# EAGLE design Debug Board - Rev. A (EAGLE 9.6.2)
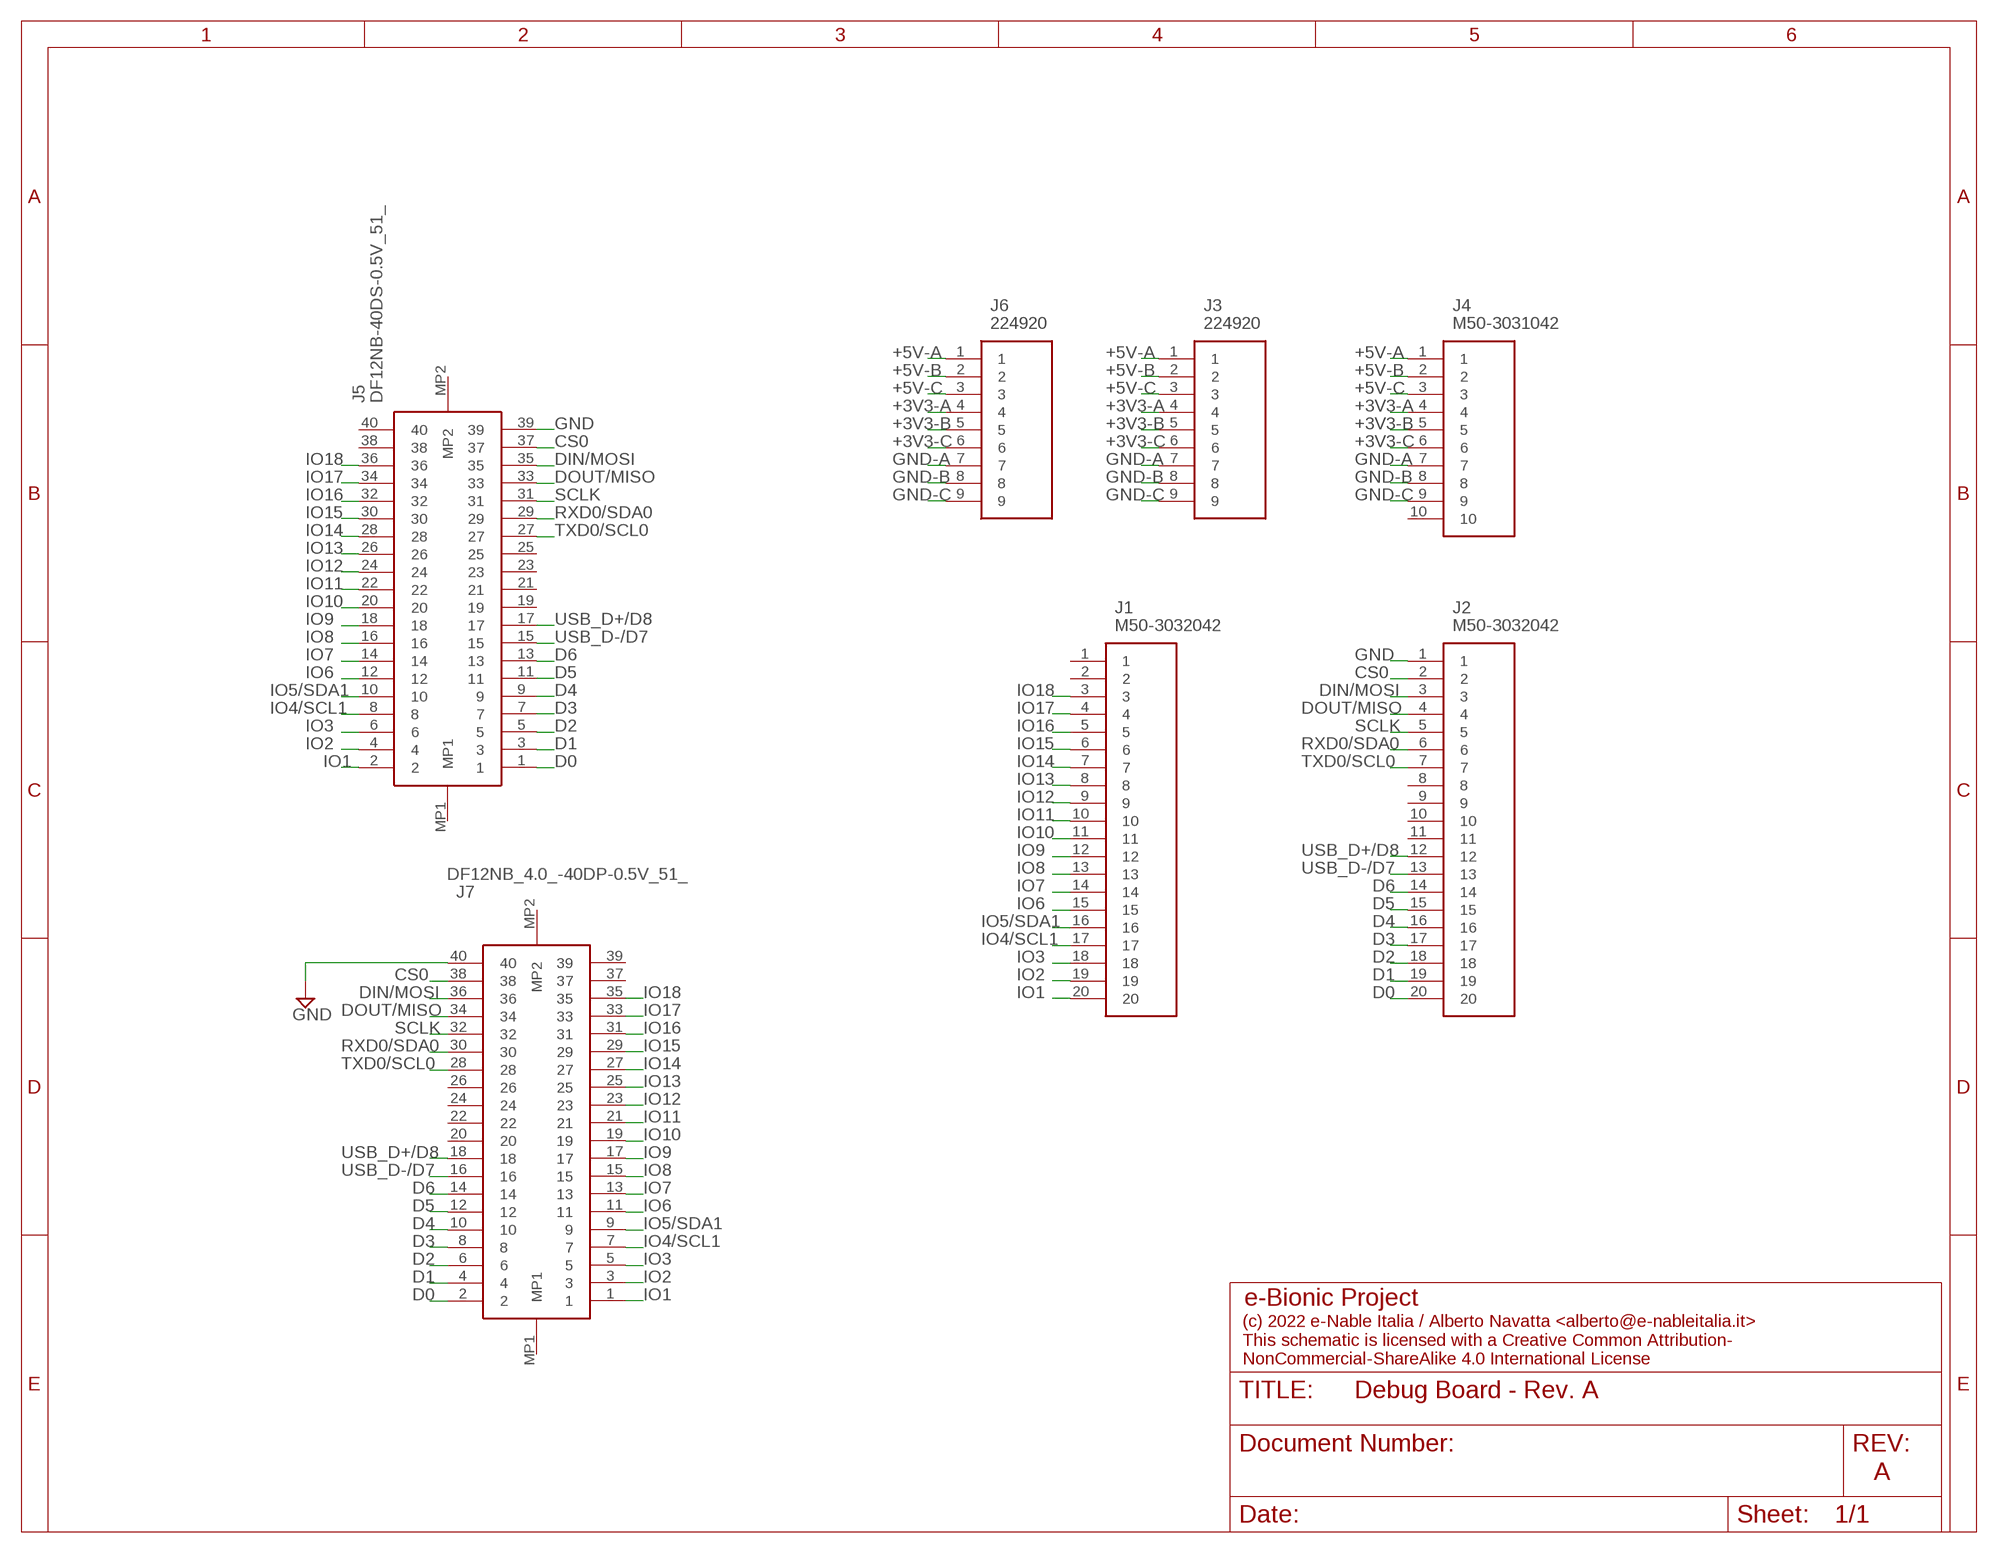
[diagram p0: schematic, sheet 1]

## Parts
J1  M50-3032042  [M503032042]
J2  M50-3032042  [M503032042]
J3  224920  [224920]
J4  M50-3031042  [M503031042]
J5  DF12NB-40DS-0.5V_51_  [DF12NB40DS05V51]
J6  224920  [224920]
J7  DF12NB_4.0_-40DP-0.5V_51_  [DF12NB4040DP05V51]

## Nets
+3V3-A [Power]: J3.4 J4.4 J6.4
+3V3-B [Power]: J3.5 J4.5 J6.5
+3V3-C [Power]: J3.6 J4.6 J6.6
+5V-A [Power]: J3.1 J4.1 J6.1
+5V-B [Power]: J3.2 J4.2 J6.2
+5V-C [Power]: J3.3 J4.3 J6.3
CS0: J2.2 J5.37 J7.38
D0: J2.20 J5.1 J7.2
D1: J2.19 J5.3 J7.4
D2: J2.18 J5.5 J7.6
D3: J2.17 J5.7 J7.8
D4: J2.16 J5.9 J7.10
D5: J2.15 J5.11 J7.12
D6: J2.14 J5.13 J7.14
DIN/MOSI: J2.3 J5.35 J7.36
DOUT/MISO: J2.4 J5.33 J7.34
GND [GND]: J2.1 J5.39 J7.40
GND-A [GND]: J3.7 J4.7 J6.7
GND-B [GND]: J3.8 J4.8 J6.8
GND-C [GND]: J3.9 J4.9 J6.9
IO1: J1.20 J5.2 J7.1
IO2: J1.19 J5.4 J7.3
IO3: J1.18 J5.6 J7.5
IO4/SCL1: J1.17 J5.8 J7.7
IO5/SDA1: J1.16 J5.10 J7.9
IO6: J1.15 J5.12 J7.11
IO7: J1.14 J5.14 J7.13
IO8: J1.13 J5.16 J7.15
IO9: J1.12 J5.18 J7.17
IO10: J1.11 J5.20 J7.19
IO11: J1.10 J5.22 J7.21
IO12: J1.9 J5.24 J7.23
IO13: J1.8 J5.26 J7.25
IO14: J1.7 J5.28 J7.27
IO15: J1.6 J5.30 J7.29
IO16: J1.5 J5.32 J7.31
IO17: J1.4 J5.34 J7.33
IO18: J1.3 J5.36 J7.35
RXD0/SDA0: J2.6 J5.29 J7.30
SCLK: J2.5 J5.31 J7.32
TXD0/SCL0: J2.7 J5.27 J7.28
USB_D+/D8: J2.12 J5.17 J7.18
USB_D-/D7: J2.13 J5.15 J7.16
Unconnected: J1.1 J1.2 J2.8 J2.9 J2.10 J2.11 J4.10 J5.19 J5.21 J5.23 J5.25 J5.38 J5.40 J5.MP1 J5.MP2 J7.20 J7.22 J7.24 J7.26 J7.37 J7.39 J7.MP1 J7.MP2

## Notes on the sheet
- e-Bionic Project
- (c) 2022 e-Nable Italia / Alberto Navatta <alberto@e-nableitalia.it>
  This schematic is licensed with a Creative Common Attribution-
  NonCommercial-ShareAlike 4.0 International License
- A

## Library data of the parts
J1 J2 = SamacSys_Parts:M50-3032042: Headers & Wire Housings 20 WAY SIL VERT PC TAIL SKT Source: Datasheet <https://cdn.harwin.com/pdfs/M50-303.pdf>; DESCRIPTION: Headers & Wire Housings 20 WAY SIL VERT PC TAIL SKT; HEIGHT: 4.55mm; MANUFACTURER_NAME: Harwin; MANUFACTURER_PART_NUMBER: M50-3032042; MOUSER_PART_NUMBER: 855-M50-3032042; MOUSER_PRICE-STOCK: https://www.mouser.co.uk/ProductDetail/Harwin/M50-3032042?qs=%252BdQmOuGyFcG1Q4VMzC2p1Q%3D%3D
J3 J6 = SamacSys_Parts:224920: Board to Board & Mezzanine Connectors 9P 0.8MM VERT FML CLASS 4 3MM SMT Source: Datasheet; DESCRIPTION: Board to Board & Mezzanine Connectors 9P 0.8MM VERT FML CLASS 4 3MM SMT; HEIGHT: 3.96mm; MANUFACTURER_NAME: ERNI; MANUFACTURER_PART_NUMBER: 224920; MOUSER_PART_NUMBER: 305-224920; MOUSER_PRICE-STOCK: https://www.mouser.co.uk/ProductDetail/ERNI/224920?qs=Kh9WxvXxjWmfiTh6L%2FvUxg%3D%3D
J4 = SamacSys_Parts:M50-3031042: Headers & Wire Housings 10 WAY SIL VERT PC TAIL SKT Source: Datasheet <https://cdn.harwin.com/pdfs/M50-303.pdf>; DESCRIPTION: Headers & Wire Housings 10 WAY SIL VERT PC TAIL SKT; HEIGHT: 4.55mm; MANUFACTURER_NAME: Harwin; MANUFACTURER_PART_NUMBER: M50-3031042; MOUSER_PART_NUMBER: 855-M50-3031042; MOUSER_PRICE-STOCK: https://www.mouser.co.uk/ProductDetail/Harwin/M50-3031042?qs=%252BdQmOuGyFcGr7bDrWORUuA%3D%3D
J5 = SamacSys_Parts:DF12NB-40DS-0.5V_51_: Board to Board & Mezzanine Connectors CONN RCPT 36POS SMD Source: Datasheet <https://www.hirose.com/en/product/document?clcode=CL0537-0290-0-51&productname=DF12NB-40DS-0.5V(51)&series=DF12N&documenttype=2DDrawing&lang=en&documentid=0001367362>; DESCRIPTION: Board to Board & Mezzanine Connectors CONN RCPT 36POS SMD; HEIGHT: 2.9mm; MANUFACTURER_NAME: Hirose; MANUFACTURER_PART_NUMBER: DF12NB-40DS-0.5V(51); MOUSER_PART_NUMBER: 798-DF12NB40DS0551; MOUSER_PRICE-STOCK: https://www.mouser.co.uk/ProductDetail/Hirose-Connector/DF12NB-40DS-0.5V51?qs=DPoM0jnrROV9WbEBnogTmg%3D%3D
J7 = SamacSys_Parts:DF12NB_4.0_-40DP-0.5V_51_: Board to!! Board !! & Mezzanine Connectors CONN HDR 40POS SMD G Source: Datasheet <https://www.hirose.com/en/product/document?clcode=CL0537-0596-0-51&productname=DF12NB(4.0)-40DP-0.5V(51)&series=DF12N&documenttype=2DDrawing&lang=en&documentid=0001367371>; DESCRIPTION: Board to!! Board !! & Mezzanine Connectors CONN HDR 40POS SMD G; HEIGHT: 3.5mm; MANUFACTURER_NAME: Hirose; MANUFACTURER_PART_NUMBER: DF12NB(4.0)-40DP-0.5V(51); MOUSER_PART_NUMBER: 798-DF12NB4040DP0551; MOUSER_PRICE-STOCK: https://www.mouser.co.uk/ProductDetail/Hirose-Connector/DF12NB4.0-40DP-0.5V51?qs=DPoM0jnrROUKZpllIjGjYw%3D%3D

## Net classes
2 Power: width 0.203 mm

## Board
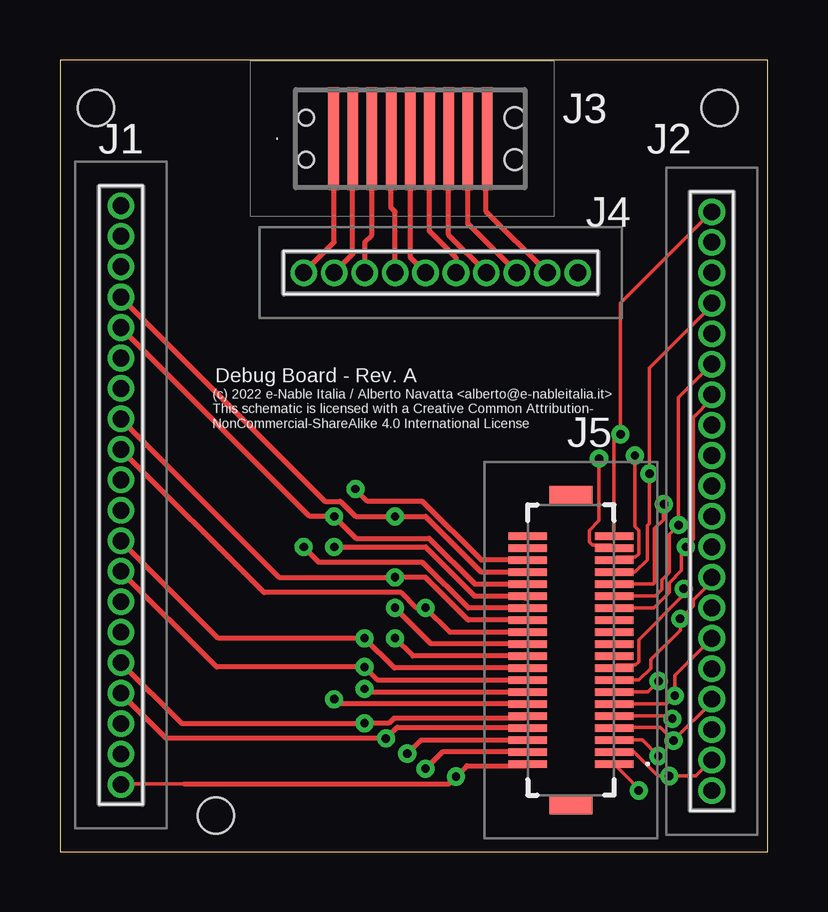
[diagram p1: board, top side]
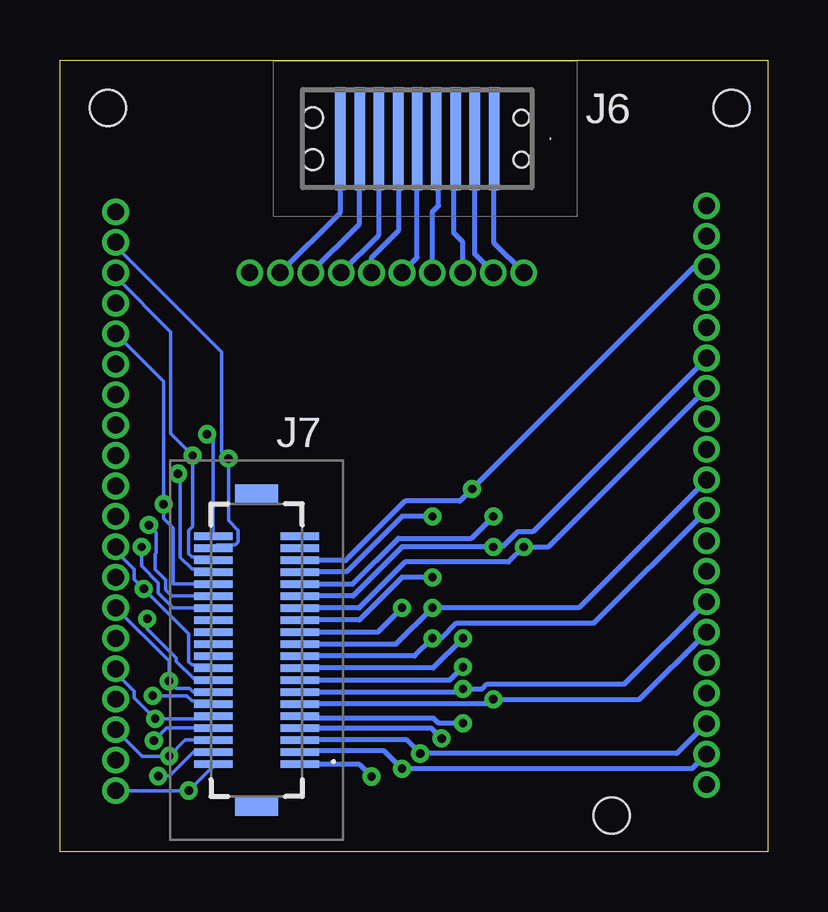
[diagram p2: board, bottom side, seen from below]

Size 29.5 x 33 mm. Coordinates in mm from the lower left corner, seen from the top.
Outline: 0,0 29.5,0 29.5,33 0,33 0,0
Copper layers (1*16): Top 0.035mm / dielectric 1.5mm / Bottom 0.035mm
Design rules "default *": minimum track width 6mil, minimum drill 0.35mm, track to track 6mil, track to pad 6mil, pad to pad 6mil, via to via 6mil, smd to smd 6mil, copper to edge 18mil, drill to drill 6mil, minimum pad ring 8mil, minimum via ring 8mil, stop-mask expansion 4mil, vias tented up to drill 0mil, thermal gap 10mil
Holes 1.5 mm at 1.5,31 27.5,31 6.5,1.5

### Footprints (pad centres in the part's own frame; a part is rotated, then mirrored left to right if it is on the bottom)
M503032042 = drill 0.7 pad 1.1: 1 0,0; 2 1.27,0; 3 2.54,0; 4 3.81,0; 5 5.08,0; 6 6.35,0; 7 7.62,0; 8 8.89,0; 9 10.16,0; 10 11.43,0; 11 12.7,0; 12 13.97,0; 13 15.24,0; 14 16.51,0; 15 17.78,0; 16 19.05,0; 17 20.32,0; 18 21.59,0; 19 22.86,0; 20 24.13,0
224920 = smd 0.44 x 4.3: 1 -3.2,0; 2 -2.4,0; 3 -1.6,0; 4 -0.8,0; 5 0,0; 6 0.8,0; 7 1.6,0; 8 2.4,0; 9 3.2,0 | hole 0.65: -4.35,0.88 | hole 0.85: 4.35,0.88
M503031042 = drill 0.7 pad 1.1: 1 0,0; 2 1.27,0; 3 2.54,0; 4 3.81,0; 5 5.08,0; 6 6.35,0; 7 7.62,0; 8 8.89,0; 9 10.16,0; 10 11.43,0
DF12NB40DS05V51 = smd 0.3 x 1.6: 1 -4.75,-1.8; 2 -4.75,1.8; 3 -4.25,-1.8; 4 -4.25,1.8; 5 -3.75,-1.8; 6 -3.75,1.8; 7 -3.25,-1.8; 8 -3.25,1.8; 9 -2.75,-1.8; 10 -2.75,1.8; 11 -2.25,-1.8; 12 -2.25,1.8; 13 -1.75,-1.8; 14 -1.75,1.8; 15 -1.25,-1.8; 16 -1.25,1.8; 17 -0.75,-1.8; 18 -0.75,1.8; 19 -0.25,-1.8; 20 -0.25,1.8; 21 0.25,-1.8; 22 0.25,1.8; 23 0.75,-1.8; 24 0.75,1.8; 25 1.25,-1.8; 26 1.25,1.8; 27 1.75,-1.8; 28 1.75,1.8; 29 2.25,-1.8; 30 2.25,1.8; 31 2.75,-1.8; 32 2.75,1.8; 33 3.25,-1.8; 34 3.25,1.8; 35 3.75,-1.8; 36 3.75,1.8; 37 4.25,-1.8; 38 4.25,1.8; 39 4.75,-1.8; 40 4.75,1.8 | smd 0.8 x 1.8: MP1 -6.45,0; MP2 6.45,0
DF12NB4040DP05V51 = smd 0.3 x 1.6: 1 -4.75,-1.8; 2 -4.75,1.8; 3 -4.25,-1.8; 4 -4.25,1.8; 5 -3.75,-1.8; 6 -3.75,1.8; 7 -3.25,-1.8; 8 -3.25,1.8; 9 -2.75,-1.8; 10 -2.75,1.8; 11 -2.25,-1.8; 12 -2.25,1.8; 13 -1.75,-1.8; 14 -1.75,1.8; 15 -1.25,-1.8; 16 -1.25,1.8; 17 -0.75,-1.8; 18 -0.75,1.8; 19 -0.25,-1.8; 20 -0.25,1.8; 21 0.25,-1.8; 22 0.25,1.8; 23 0.75,-1.8; 24 0.75,1.8; 25 1.25,-1.8; 26 1.25,1.8; 27 1.75,-1.8; 28 1.75,1.8; 29 2.25,-1.8; 30 2.25,1.8; 31 2.75,-1.8; 32 2.75,1.8; 33 3.25,-1.8; 34 3.25,1.8; 35 3.75,-1.8; 36 3.75,1.8; 37 4.25,-1.8; 38 4.25,1.8; 39 4.75,-1.8; 40 4.75,1.8 | smd 0.8 x 1.8: MP1 -6.5,0; MP2 6.5,0

### Placement (x,y rotation side)
J1  2.54,26.92 270 top
J2  27.18,26.67 270 top
J3  14.61,29.72 0 top
J4  10.16,24.13 0 top
J5  21.3,8.4 90 top
J6  14.61,29.72 180 bottom
J7  21.3,8.4 90 bottom

### Tracks (layer width: path | path; a pad name or v marks a point on that pad's centre or on a via)
+3V3-A
  Top 0.203: J4.4 13.97,26.67 13.8,26.84 J6.4
  Bottom 0.203: J6.4 13.72,29.63 13.72,26.92 13.97,26.67 J4.4
+3V3-B
  Top 0.203: J4.5 14.61,24.77 J6.5
  Bottom 0.203: J4.5 14.61,24.77 J6.5
+3V3-C
  Top 0.203: J4.6 16.51,24.77 15.4,25.87 J6.6
  Bottom 0.203: J4.6 16.51,24.77 15.37,25.91 15.37,29.68 J6.6
+5V-A
  Top 0.203: J6.1 11.43,29.69 11.43,25.4 J4.1
  Bottom 0.203: J4.1 11.4,25.38 J6.1
+5V-B
  Top 0.203: J4.2 12.21,24.91 J6.2
  Bottom 0.203: J6.2 12.21,24.91 J4.2
+5V-C
  Top 0.203: J4.3 12.7,25.4 13.01,25.7 J6.3
  Bottom 0.203: J4.3 12.7,25.4 13.08,25.78 13.08,29.64 J6.3
CS0  (via drill 0.35)
  Top 0.152: 23.16,12.72 J7.38 22.98,12.77 22.2,12.77 22.07,12.9 22.07,13.39 22.48,13.8 v22.48,16.38
  Bottom 0.152: J7.38 22.98,12.77 22.2,12.77 22.07,12.9 22.07,13.39 22.48,13.8 v22.48,16.38 22.76,16.66 22.76,20.82 27.18,25.24 J2.2
D0  (via drill 0.35)
  Top 0.152: 23.16,3.58 J7.2 24.13,2.62 v24.13,2.54
  Bottom 0.152: J2.20 v24.13,2.54 23.1,3.57
  Bottom 0.203: J7.2 23.1,3.57
D1  (via drill 0.35)
  Top 0.152: 23.16,4.12 J7.4 23.92,4.15 24.92,3.15 v25.4,3.15 26.52,3.15 J2.19
  Bottom 0.152: J7.4 23.92,4.15 24.92,3.15 v25.4,3.15
D2  (via drill 0.35)
  Top 0.152: 23.16,4.72 J7.6 24.27,4.65 v24.95,3.98
  Bottom 0.152: J2.18 26.08,3.98 v24.95,3.98 24.27,4.65 J7.6
D3  (via drill 0.35)
  Top 0.152: J7.8 23.16,5.18 25.03,5.18 v25.58,4.63 27.18,6.22 J2.17
  Bottom 0.152: J7.8 25.06,5.15 v25.58,4.63
D4  (via drill 0.35)
  Top 0.152: 23.16,5.71 J7.10 25.42,5.65 v25.53,5.54
  Bottom 0.152: J2.16 27.18,7.46 26.4,6.67 26.4,6.4 v25.53,5.54 23.21,5.54 J7.10
D5  (via drill 0.35)
  Top 0.152: 23.16,6.17 J7.12 25.29,6.15 v25.63,6.5 25.63,7.35 J2.15
  Bottom 0.152: J7.12 23.22,6.27 24,6.27 24.22,6.5 v25.63,6.5
D6  (via drill 0.35)
  Top 0.152: 23.16,6.71 J7.14 24.5,6.65 v24.96,7.1
  Bottom 0.152: J2.14 24.96,7.94 v24.96,7.1 24.65,6.8 24.09,6.8 23.94,6.65 J7.14
DIN/MOSI  (via drill 0.35)
  Top 0.152: 23.16,12.19 J7.36 23.22,12.27 24,12.27 24.13,12.4 24.13,13.39 23.97,13.55 v23.97,16.51 | 27.18,24.04 J2.3
  Bottom 0.152: J7.36 23.22,12.27 24,12.27 24.13,12.4 24.13,13.39 23.97,13.55 v23.97,16.51 24.88,17.42 24.88,21.66 27.18,23.97 J2.3
DOUT/MISO  (via drill 0.35)
  Top 0.152: J2.4 27.18,22.77 24.58,20.16 v24.58,15.75 24.58,13.68 24.48,13.59 24.48,12.16 23.97,11.65 J7.34
  Bottom 0.152: J7.34 23.22,11.77 24,11.77 24.48,12.26 24.48,15.66 v24.58,15.75
GND  (via drill 0.35)
  Top 0.152: 23.09,13.18 J7.40 23.1,17.13 v23.37,17.4 23.37,22.86 J2.1
  Bottom 0.152: v23.37,17.4 23.11,17.14 23.11,13.16 J7.40
GND-A
  Top 0.203: J4.7 16.2,25.7 J6.7
  Bottom 0.203: J4.7 16.2,25.7 J6.7
GND-B
  Top 0.152: 17.14,27.96 17.04,29.25 J6.8
  Top 0.203: J4.8 17,26.18 17,29.21 17.04,29.25
  Bottom 0.203: J4.8 17.02,26.16 17.02,29.7 J6.8
GND-C
  Top 0.152: 17.68,27.96 17.77,29.21 J6.9 | 20.34,24.08 J4.9 20.41,24.13
  Top 0.203: 17.77,29.21 17.77,26.68 J4.9
  Bottom 0.203: J4.9 17.8,26.64 J6.9
IO1  (via drill 0.35)
  Top 0.152: 19.43,3.58 J7.1 | 5.18,2.82 2.59,2.82 J1.20
  Top 0.203: 19.43,3.58 16.96,3.58 v16.51,3.13 16.2,2.82 5.18,2.82
  Bottom 0.203: J7.1 17.03,3.65 v16.51,3.13
IO2  (via drill 0.35)
  Top 0.152: 19.43,4.12 J7.3 | 2.59,4.12 J1.19
  Top 0.203: J7.3 15.94,4.15 v15.24,3.45
  Bottom 0.203: J7.3 19.46,4.19 15.98,4.19 v15.24,3.45 3.15,3.45 J1.19
IO3  (via drill 0.35)
  Top 0.152: 19.43,4.72 J7.5
  Top 0.203: v14.48,4.08 15.04,4.65 J7.5
  Bottom 0.203: J1.18 3.79,4.08 v14.48,4.08 15.04,4.65 J7.5
IO4/SCL1  (via drill 0.35)
  Top 0.152: 19.43,5.18 J7.7
  Top 0.203: 19.43,5.18 14.05,5.18 v13.59,4.72 4.43,4.72 J1.17
  Bottom 0.203: J7.7 14.02,5.15 v13.59,4.72
IO5/SDA1  (via drill 0.35)
  Top 0.152: J7.9 19.43,5.71
  Top 0.203: J1.16 5.07,5.35 v12.7,5.35 13.72,5.35 13.92,5.55 19.4,5.55 J7.9
  Bottom 0.203: v12.7,5.35 13.72,5.35 13.92,5.55 19.4,5.55 J7.9
IO6  (via drill 0.35)
  Top 0.152: 19.43,6.17 J7.11
  Top 0.203: J7.11 11.63,6.15 v11.43,6.35
  Bottom 0.203: J7.11 11.63,6.15 v11.43,6.35 5.33,6.35 J1.15
IO7  (via drill 0.35)
  Top 0.203: v12.7,6.78 12.83,6.65 J7.13
  Bottom 0.203: J7.13 12.83,6.65 v12.7,6.78 11.89,6.78 11.69,6.98 5.97,6.98 J1.14
IO8  (via drill 0.35)
  Top 0.152: 19.43,7.16 J7.15
  Top 0.203: J1.13 6.53,7.69 v12.7,7.69 13.23,7.16 19.43,7.16
  Bottom 0.203: J7.15 13.24,7.15 v12.7,7.69
IO9  (via drill 0.35)
  Top 0.152: 19.43,7.7 J7.17
  Top 0.203: J7.17 13.94,7.65 v12.7,8.89 6.6,8.89 J1.12
  Bottom 0.203: v12.7,8.89 13.94,7.65 J7.17
IO10  (via drill 0.35)
  Top 0.152: 19.43,8.15 J7.19
  Top 0.203: J7.19 14.71,8.15 v13.97,8.89
  Bottom 0.203: J1.11 7.24,9.52 12.96,9.52 13.59,8.89 v13.97,8.89 14.71,8.15 J7.19
IO11  (via drill 0.35)
  Top 0.152: 19.43,8.69 J7.21
  Top 0.203: v13.97,10.16 15.44,8.69 19.43,8.69
  Bottom 0.203: J7.21 15.48,8.65 v13.97,10.16 7.87,10.16 J1.10
IO12  (via drill 0.35)
  Top 0.152: 19.43,9.22 J7.23
  Top 0.203: J7.23 16.25,9.15 v15.24,10.16 14.86,10.16 14.23,10.79 8.51,10.79 J1.9
  Bottom 0.203: J7.23 16.25,9.15 v15.24,10.16
IO13  (via drill 0.35)
  Top 0.152: 19.43,9.68 J7.25
  Top 0.203: J7.25 17.02,9.65 15.24,11.43 v13.97,11.43 9.14,11.43 J1.8
  Bottom 0.203: v13.97,11.43 15.24,11.43 17.02,9.65 J7.25
IO14  (via drill 0.35)
  Top 0.152: 19.43,10.21 J7.27
  Top 0.203: J7.27 17.02,10.15 15.11,12.06 10.8,12.06 v10.16,12.7
  Bottom 0.203: J7.27 17.03,10.15 15.11,12.06 10.79,12.06 v10.16,12.7 9.14,12.7 J1.7
IO15  (via drill 0.35)
  Top 0.152: 19.51,10.67 J7.29
  Top 0.203: v11.43,12.7 15.24,12.7 17.29,10.65 J7.29 | 19.39,10.55 19.51,10.67
  Bottom 0.203: J1.6 9.78,13.33 10.42,13.33 11.05,12.7 v11.43,12.7 15.24,12.7 17.29,10.65 J7.29
IO16  (via drill 0.35)
  Top 0.152: 19.43,11.2 J7.31
  Top 0.203: J7.31 17.29,11.15 15.39,13.06 12.34,13.06 v11.43,13.97 10.41,13.97 J1.5
  Bottom 0.203: J7.31 17.29,11.15 15.39,13.06 12.34,13.06 v11.43,13.97
IO17  (via drill 0.35)
  Top 0.152: J7.33
  Top 0.203: J1.4 11.05,14.6 11.69,14.6 12.32,13.97 v13.97,13.97 15.24,13.97 17.55,11.66 J7.33
  Bottom 0.203: v13.97,13.97 15.24,13.97 17.53,11.68 19.47,11.68 J7.33
IO18  (via drill 0.35)
  Top 0.152: 19.43,12.19 J7.35
  Top 0.203: J7.35 17.56,12.15 15.11,14.6 12.83,14.6 v12.32,15.11
  Bottom 0.203: J7.35 19.48,12.13 17.59,12.13 17.53,12.19 15.11,14.61 12.83,14.61 v12.32,15.11 3.05,24.38 J1.3
RXD0/SDA0  (via drill 0.35)
  Top 0.152: J2.6 25.79,18.93 v25.79,13.61 25.4,13.22 25.4,11.63 25.09,11.33 25.09,10.92 24.82,10.65 J7.30
  Bottom 0.152: J7.30 24.84,10.65 25.09,10.9 25.09,11.33 25.53,11.76 25.53,12.41 25.49,12.45 25.49,13.31 v25.79,13.61
SCLK  (via drill 0.35)
  Top 0.152: 23.16,11.2 J7.32 24.74,11.15 24.79,11.2 24.79,13.47 25.15,13.82 25.15,14.44 v25.18,14.48
  Bottom 0.152: J7.32 24.76,11.15 24.79,11.18 24.79,13.49 25.18,13.88 v25.18,14.48 25.18,19.59 J2.5
TXD0/SCL0  (via drill 0.35)
  Top 0.152: J2.7 27.18,18.89 26.4,18.1 26.4,13 v26.09,12.7 25.91,12.51 25.91,11.71 25.4,11.2 25.4,10.79 24.75,10.15 J7.28
  Bottom 0.152: 26.09,12.38 v26.09,12.7 26.09,11.9 25.4,11.2 25.4,10.78 24.77,10.15 J7.28
USB_D+/D8  (via drill 0.35)
  Top 0.152: 23.16,7.7 J7.18 23.22,7.77 24,7.77 24.13,7.91 24.13,8.83 26.04,10.73 26.04,10.92 v26.01,10.95
  Bottom 0.152: J2.12 27.18,12.54 26.4,11.75 26.4,11.34 v26.01,10.95 24.13,9.07 24.13,7.91 24,7.77 23.22,7.77 J7.18
USB_D-/D7  (via drill 0.35)
  Top 0.152: 23.16,7.16 J7.16 24.14,7.15 24.64,7.64 24.64,8 25.86,9.22 v25.86,9.7 26.4,10.24 26.4,10.48 27.18,11.27 J2.13
  Bottom 0.152: J7.16 23.87,7.15 24.65,7.93 24.65,8.06 25.86,9.27 v25.86,9.7

### Text on the board
tNames: Debug Board - Rev. A | (c) 2022 e-Nable Italia / Alberto Navatta <alberto@e-nableitalia.it> / This schematic is licensed with a Creative Common Attribution- / NonCommercial-ShareAlike 4.0 International License